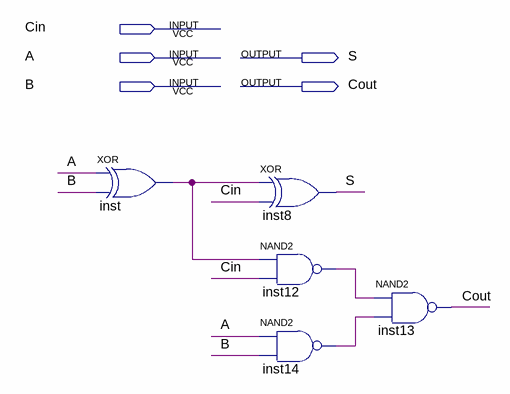
[diagram p0: schematic sheet]
// Quartus schematic fa.bdf as structural Verilog: 5 symbols, 5 pins
module fa (
  input  Cin,
  input  A,
  input  B,
  output S,
  output Cout
);

  wire inst12_out, inst14_out, inst_out;

  xor inst (inst_out, A, B);
  xor inst8 (S, inst_out, Cin);
  nand inst12 (inst12_out, inst_out, Cin);
  nand inst14 (inst14_out, A, B);
  nand inst13 (Cout, inst12_out, inst14_out);
endmodule
